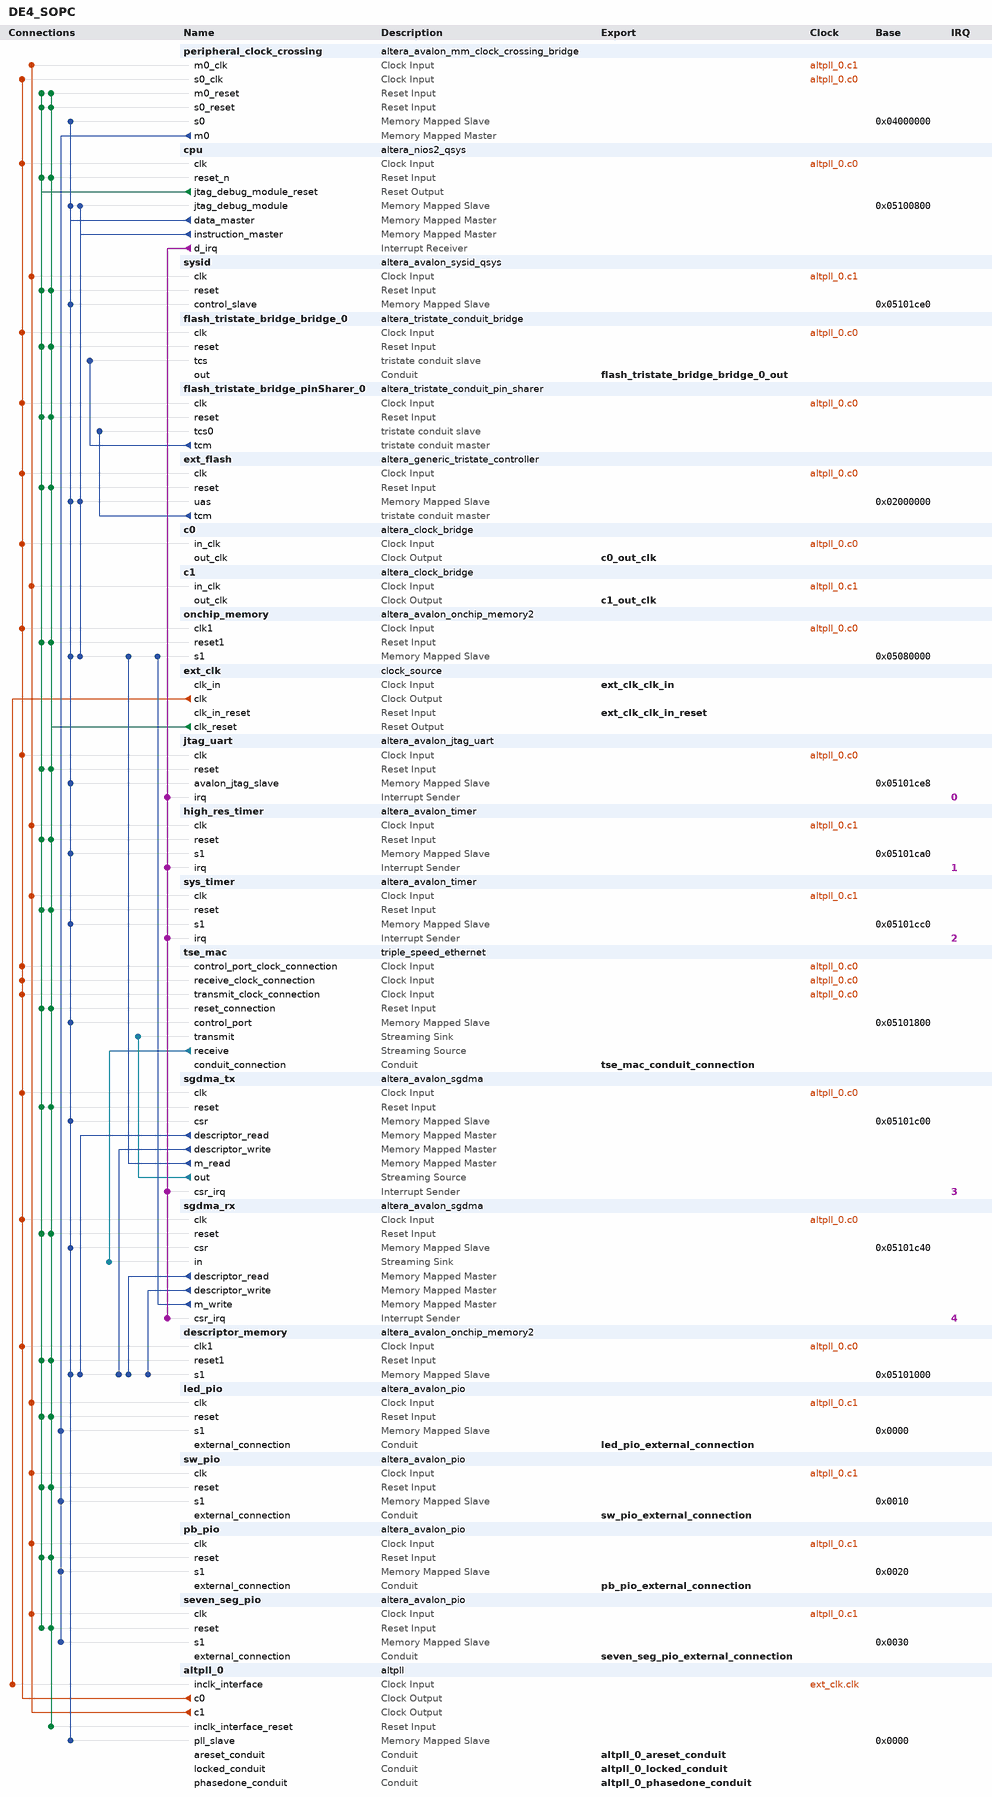
[diagram p0: system contents]
# Platform Designer (Qsys) system DE4_SOPC
# Parameters at their usual value, and those the tool derives, are not listed.
package require -exact qsys 11.1
create_system DE4_SOPC
set_project_property DEVICE_FAMILY STRATIXIV

add_instance peripheral_clock_crossing altera_avalon_mm_clock_crossing_bridge 11.1
set_instance_parameter_value peripheral_clock_crossing DATA_WIDTH 32
set_instance_parameter_value peripheral_clock_crossing ADDRESS_WIDTH 6
set_instance_parameter_value peripheral_clock_crossing MAX_BURST_SIZE 1
set_instance_parameter_value peripheral_clock_crossing COMMAND_FIFO_DEPTH 16
set_instance_parameter_value peripheral_clock_crossing RESPONSE_FIFO_DEPTH 64
set_instance_parameter_value peripheral_clock_crossing MASTER_SYNC_DEPTH 3
set_instance_parameter_value peripheral_clock_crossing SLAVE_SYNC_DEPTH 3

add_instance cpu altera_nios2_qsys 11.1
set_instance_parameter_value cpu manuallyAssignCpuID false
set_instance_parameter_value cpu resetSlave onchip_memory.s1
set_instance_parameter_value cpu exceptionSlave onchip_memory.s1
set_instance_parameter_value cpu breakSlave cpu.jtag_debug_module
set_instance_parameter_value cpu muldiv_multiplierType DSPBlock
set_instance_parameter_value cpu impl Fast
set_instance_parameter_value cpu icache_size 4096

add_instance sysid altera_avalon_sysid_qsys 11.1
set_instance_parameter_value sysid id 0

add_instance flash_tristate_bridge_bridge_0 altera_tristate_conduit_bridge 11.1

add_instance flash_tristate_bridge_pinSharer_0 altera_tristate_conduit_pin_sharer 11.1
set_instance_parameter_value flash_tristate_bridge_pinSharer_0 NUM_INTERFACES 1
set_instance_parameter_value flash_tristate_bridge_pinSharer_0 MODULE_ORIGIN_LIST ext_flash.tcm,ext_flash.tcm,ext_flash.tcm,ext_flash.tcm,ext_flash.tcm
set_instance_parameter_value flash_tristate_bridge_pinSharer_0 SHARED_SIGNAL_LIST flash_tristate_bridge_address,flash_tristate_bridge_readn,flash_tristate_bridge_writen,flash_tristate_bridge_data,select_n_to_the_ext_flash

add_instance ext_flash altera_generic_tristate_controller 11.1
set_instance_parameter_value ext_flash TCM_ADDRESS_W 25
set_instance_parameter_value ext_flash TCM_DATA_W 16
set_instance_parameter_value ext_flash TCM_BYTEENABLE_W 2
set_instance_parameter_value ext_flash TCM_READ_WAIT 100
set_instance_parameter_value ext_flash TCM_WRITE_WAIT 100
set_instance_parameter_value ext_flash TCM_SETUP_WAIT 25
set_instance_parameter_value ext_flash TCM_DATA_HOLD 20
set_instance_parameter_value ext_flash TCM_MAX_PENDING_READ_TRANSACTIONS 3
set_instance_parameter_value ext_flash TCM_TURNAROUND_TIME 2
set_instance_parameter_value ext_flash TCM_TIMING_UNITS 0
set_instance_parameter_value ext_flash TCM_READLATENCY 2
set_instance_parameter_value ext_flash TCM_SYMBOLS_PER_WORD 2
set_instance_parameter_value ext_flash USE_READ 1
set_instance_parameter_value ext_flash USE_BEGINTRANSFER 0
set_instance_parameter_value ext_flash USE_BYTEENABLE 0
set_instance_parameter_value ext_flash USE_OUTPUTENABLE 0
set_instance_parameter_value ext_flash ACTIVE_LOW_READ 1
set_instance_parameter_value ext_flash ACTIVE_LOW_BYTEENABLE 0
set_instance_parameter_value ext_flash ACTIVE_LOW_OUTPUTENABLE 0
set_instance_parameter_value ext_flash ACTIVE_LOW_BEGINTRANSFER 0
set_instance_parameter_value ext_flash CHIPSELECT_THROUGH_READLATENCY 0
set_instance_parameter_value ext_flash MODULE_ASSIGNMENT_KEYS embeddedsw.configuration.hwClassnameDriverSupportList,embeddedsw.configuration.hwClassnameDriverSupportDefault,embeddedsw.CMacro.SETUP_VALUE,embeddedsw.CMacro.WAIT_VALUE,embeddedsw.CMacro.HOLD_VALUE,embeddedsw.CMacro.TIMING_UNITS,embeddedsw.CMacro.SIZE,embeddedsw.memoryInfo.MEM_INIT_DATA_WIDTH,embeddedsw.memoryInfo.HAS_BYTE_LANE,embeddedsw.memoryInfo.IS_FLASH,embeddedsw.memoryInfo.GENERATE_DAT_SYM,embeddedsw.memoryInfo.GENERATE_FLASH,embeddedsw.memoryInfo.DAT_SYM_INSTALL_DIR,embeddedsw.memoryInfo.FLASH_INSTALL_DIR
set_instance_parameter_value ext_flash MODULE_ASSIGNMENT_VALUES {altera_avalon_lan91c111:altera_avalon_cfi_flash,altera_avalon_cfi_flash,25,100,20,"ns",33554432u,16,1,1,1,1,SIM_DIR,APP_DIR}
set_instance_parameter_value ext_flash INTERFACE_ASSIGNMENT_KEYS embeddedsw.configuration.isFlash,embeddedsw.configuration.isMemoryDevice,embeddedsw.configuration.isNonVolatileStorage
set_instance_parameter_value ext_flash INTERFACE_ASSIGNMENT_VALUES 1,1,1

add_instance c0 altera_clock_bridge 11.1
set_instance_parameter_value c0 DERIVED_CLOCK_RATE 50000000
set_instance_parameter_value c0 EXPLICIT_CLOCK_RATE 0

add_instance c1 altera_clock_bridge 11.1
set_instance_parameter_value c1 DERIVED_CLOCK_RATE 10000000
set_instance_parameter_value c1 EXPLICIT_CLOCK_RATE 0

add_instance onchip_memory altera_avalon_onchip_memory2 11.1
set_instance_parameter_value onchip_memory blockType M9K
set_instance_parameter_value onchip_memory dataWidth 32
set_instance_parameter_value onchip_memory dualPort false
set_instance_parameter_value onchip_memory initMemContent true
set_instance_parameter_value onchip_memory initializationFileName onchip_memory
set_instance_parameter_value onchip_memory memorySize 512000

add_instance ext_clk clock_source 11.1
set_instance_parameter_value ext_clk clockFrequency 50000000

add_instance jtag_uart altera_avalon_jtag_uart 11.1
set_instance_parameter_value jtag_uart simInteractiveOptions INTERACTIVE_ASCII_OUTPUT

add_instance high_res_timer altera_avalon_timer 11.1
set_instance_parameter_value high_res_timer period 1
set_instance_parameter_value high_res_timer periodUnits MSEC
set_instance_parameter_value high_res_timer timerPreset CUSTOM

add_instance sys_timer altera_avalon_timer 11.1
set_instance_parameter_value sys_timer period 10
set_instance_parameter_value sys_timer periodUnits MSEC
set_instance_parameter_value sys_timer timerPreset CUSTOM

add_instance tse_mac triple_speed_ethernet 11.1
set_instance_parameter_value tse_mac atlanticSinkClockRate 0
set_instance_parameter_value tse_mac atlanticSinkClockSource unassigned
set_instance_parameter_value tse_mac atlanticSourceClockRate 0
set_instance_parameter_value tse_mac atlanticSourceClockSource unassigned
set_instance_parameter_value tse_mac avalonSlaveClockRate 0
set_instance_parameter_value tse_mac avalonSlaveClockSource unassigned
set_instance_parameter_value tse_mac avalonStNeighbours {unassigned=unassigned}
set_instance_parameter_value tse_mac channel_count 1
set_instance_parameter_value tse_mac core_variation MAC_PCS
set_instance_parameter_value tse_mac core_version 2817
set_instance_parameter_value tse_mac crc32check16bit 0
set_instance_parameter_value tse_mac crc32dwidth 8
set_instance_parameter_value tse_mac crc32gendelay 6
set_instance_parameter_value tse_mac crc32s1l2_extern false
set_instance_parameter_value tse_mac cust_version 0
set_instance_parameter_value tse_mac dataBitsPerSymbol 8
set_instance_parameter_value tse_mac dev_version 2817
set_instance_parameter_value tse_mac eg_addr 11
set_instance_parameter_value tse_mac ena_hash true
set_instance_parameter_value tse_mac enable_alt_reconfig false
set_instance_parameter_value tse_mac enable_clk_sharing false
set_instance_parameter_value tse_mac enable_ena 32
set_instance_parameter_value tse_mac enable_fifoless false
set_instance_parameter_value tse_mac enable_gmii_loopback false
set_instance_parameter_value tse_mac enable_hd_logic true
set_instance_parameter_value tse_mac enable_mac_flow_ctrl true
set_instance_parameter_value tse_mac enable_mac_txaddr_set true
set_instance_parameter_value tse_mac enable_mac_vlan true
set_instance_parameter_value tse_mac enable_maclite false
set_instance_parameter_value tse_mac enable_magic_detect true
set_instance_parameter_value tse_mac enable_multi_channel false
set_instance_parameter_value tse_mac enable_pkt_class true
set_instance_parameter_value tse_mac enable_pma false
set_instance_parameter_value tse_mac enable_reg_sharing false
set_instance_parameter_value tse_mac enable_sgmii true
set_instance_parameter_value tse_mac enable_shift16 true
set_instance_parameter_value tse_mac enable_sup_addr true
set_instance_parameter_value tse_mac enable_use_internal_fifo true
set_instance_parameter_value tse_mac export_calblkclk false
set_instance_parameter_value tse_mac export_pwrdn false
set_instance_parameter_value tse_mac ext_stat_cnt_ena false
set_instance_parameter_value tse_mac gigeAdvanceMode true
set_instance_parameter_value tse_mac ifGMII MII_GMII
set_instance_parameter_value tse_mac ifPCSuseEmbeddedSerdes true
set_instance_parameter_value tse_mac ing_addr 11
set_instance_parameter_value tse_mac insert_ta true
set_instance_parameter_value tse_mac maclite_gige false
set_instance_parameter_value tse_mac max_channels 1
set_instance_parameter_value tse_mac mdio_clk_div 40
set_instance_parameter_value tse_mac phy_identifier 0
set_instance_parameter_value tse_mac ramType AUTO
set_instance_parameter_value tse_mac reset_level 1
set_instance_parameter_value tse_mac starting_channel_number 0
set_instance_parameter_value tse_mac stat_cnt_ena true
set_instance_parameter_value tse_mac timingAdapterName timingAdapter
set_instance_parameter_value tse_mac toolContext SOPC_BUILDER
set_instance_parameter_value tse_mac transceiver_type LVDS_IO
set_instance_parameter_value tse_mac uiHostClockFrequency 0
set_instance_parameter_value tse_mac uiMDIOFreq {0.0 MHz}
set_instance_parameter_value tse_mac useLvds true
set_instance_parameter_value tse_mac useMAC true
set_instance_parameter_value tse_mac useMDIO true
set_instance_parameter_value tse_mac usePCS true
set_instance_parameter_value tse_mac use_sync_reset true

add_instance sgdma_tx altera_avalon_sgdma 11.1
set_instance_parameter_value sgdma_tx enableBurstTransfers false
set_instance_parameter_value sgdma_tx enableUnalignedTransfers false
set_instance_parameter_value sgdma_tx readBlockDataWidth 32
set_instance_parameter_value sgdma_tx sinkErrorWidth 0
set_instance_parameter_value sgdma_tx sourceErrorWidth 1
set_instance_parameter_value sgdma_tx transferMode MEMORY_TO_STREAM
set_instance_parameter_value sgdma_tx writeBurstcountWidth 4

add_instance sgdma_rx altera_avalon_sgdma 11.1
set_instance_parameter_value sgdma_rx enableBurstTransfers false
set_instance_parameter_value sgdma_rx enableUnalignedTransfers false
set_instance_parameter_value sgdma_rx readBlockDataWidth 32
set_instance_parameter_value sgdma_rx sinkErrorWidth 6
set_instance_parameter_value sgdma_rx sourceErrorWidth 0
set_instance_parameter_value sgdma_rx transferMode STREAM_TO_MEMORY
set_instance_parameter_value sgdma_rx writeBurstcountWidth 4

add_instance descriptor_memory altera_avalon_onchip_memory2 11.1
set_instance_parameter_value descriptor_memory dataWidth 32
set_instance_parameter_value descriptor_memory dualPort false
set_instance_parameter_value descriptor_memory initMemContent true
set_instance_parameter_value descriptor_memory initializationFileName descriptor_memory
set_instance_parameter_value descriptor_memory memorySize 2048

add_instance led_pio altera_avalon_pio 11.1
set_instance_parameter_value led_pio direction Output
set_instance_parameter_value led_pio width 8

add_instance sw_pio altera_avalon_pio 11.1
set_instance_parameter_value sw_pio direction Input
set_instance_parameter_value sw_pio width 8

add_instance pb_pio altera_avalon_pio 11.1
set_instance_parameter_value pb_pio direction Input
set_instance_parameter_value pb_pio width 4

add_instance seven_seg_pio altera_avalon_pio 11.1
set_instance_parameter_value seven_seg_pio direction Output
set_instance_parameter_value seven_seg_pio width 16

add_instance altpll_0 altpll 11.1
set_instance_parameter_value altpll_0 WIDTH_CLOCK 10
set_instance_parameter_value altpll_0 INCLK0_INPUT_FREQUENCY 20000
set_instance_parameter_value altpll_0 CLK0_MULTIPLY_BY 1
set_instance_parameter_value altpll_0 CLK1_MULTIPLY_BY 1
set_instance_parameter_value altpll_0 CLK0_DIVIDE_BY 1
set_instance_parameter_value altpll_0 CLK1_DIVIDE_BY 5
set_instance_parameter_value altpll_0 CLK1_PHASE_SHIFT 0
set_instance_parameter_value altpll_0 CLK1_DUTY_CYCLE 50
set_instance_parameter_value altpll_0 PORT_clk1 PORT_USED
set_instance_parameter_value altpll_0 PORT_clk2 PORT_UNUSED
set_instance_parameter_value altpll_0 PORT_clk3 PORT_UNUSED
set_instance_parameter_value altpll_0 PORT_clk6 PORT_UNUSED
set_instance_parameter_value altpll_0 PORT_clk7 PORT_UNUSED
set_instance_parameter_value altpll_0 PORT_clk8 PORT_UNUSED
set_instance_parameter_value altpll_0 PORT_clk9 PORT_UNUSED
set_instance_parameter_value altpll_0 PORT_ARESET PORT_USED
set_instance_parameter_value altpll_0 PORT_LOCKED PORT_USED
set_instance_parameter_value altpll_0 PORT_FBOUT PORT_UNUSED
set_instance_parameter_value altpll_0 USING_FBMIMICBIDIR_PORT OFF

# connections
add_connection altpll_0.c0 c0.in_clk clock
add_connection altpll_0.c0 cpu.clk clock
add_connection altpll_0.c0 descriptor_memory.clk1 clock
add_connection altpll_0.c0 ext_flash.clk clock
add_connection altpll_0.c0 flash_tristate_bridge_bridge_0.clk clock
add_connection altpll_0.c0 flash_tristate_bridge_pinSharer_0.clk clock
add_connection altpll_0.c0 jtag_uart.clk clock
add_connection altpll_0.c0 onchip_memory.clk1 clock
add_connection altpll_0.c0 peripheral_clock_crossing.s0_clk clock
add_connection altpll_0.c0 sgdma_rx.clk clock
add_connection altpll_0.c0 sgdma_tx.clk clock
add_connection altpll_0.c0 tse_mac.control_port_clock_connection clock
add_connection altpll_0.c0 tse_mac.receive_clock_connection clock
add_connection altpll_0.c0 tse_mac.transmit_clock_connection clock
add_connection altpll_0.c1 c1.in_clk clock
add_connection altpll_0.c1 high_res_timer.clk clock
add_connection altpll_0.c1 led_pio.clk clock
add_connection altpll_0.c1 pb_pio.clk clock
add_connection altpll_0.c1 peripheral_clock_crossing.m0_clk clock
add_connection altpll_0.c1 seven_seg_pio.clk clock
add_connection altpll_0.c1 sw_pio.clk clock
add_connection altpll_0.c1 sys_timer.clk clock
add_connection altpll_0.c1 sysid.clk clock
add_connection ext_clk.clk altpll_0.inclk_interface clock
add_connection cpu.jtag_debug_module_reset cpu.reset_n reset
add_connection cpu.jtag_debug_module_reset descriptor_memory.reset1 reset
add_connection cpu.jtag_debug_module_reset ext_flash.reset reset
add_connection cpu.jtag_debug_module_reset flash_tristate_bridge_bridge_0.reset reset
add_connection cpu.jtag_debug_module_reset flash_tristate_bridge_pinSharer_0.reset reset
add_connection cpu.jtag_debug_module_reset high_res_timer.reset reset
add_connection cpu.jtag_debug_module_reset jtag_uart.reset reset
add_connection cpu.jtag_debug_module_reset led_pio.reset reset
add_connection cpu.jtag_debug_module_reset onchip_memory.reset1 reset
add_connection cpu.jtag_debug_module_reset pb_pio.reset reset
add_connection cpu.jtag_debug_module_reset peripheral_clock_crossing.m0_reset reset
add_connection cpu.jtag_debug_module_reset peripheral_clock_crossing.s0_reset reset
add_connection cpu.jtag_debug_module_reset seven_seg_pio.reset reset
add_connection cpu.jtag_debug_module_reset sgdma_rx.reset reset
add_connection cpu.jtag_debug_module_reset sgdma_tx.reset reset
add_connection cpu.jtag_debug_module_reset sw_pio.reset reset
add_connection cpu.jtag_debug_module_reset sys_timer.reset reset
add_connection cpu.jtag_debug_module_reset sysid.reset reset
add_connection cpu.jtag_debug_module_reset tse_mac.reset_connection reset
add_connection ext_clk.clk_reset altpll_0.inclk_interface_reset reset
add_connection ext_clk.clk_reset cpu.reset_n reset
add_connection ext_clk.clk_reset descriptor_memory.reset1 reset
add_connection ext_clk.clk_reset ext_flash.reset reset
add_connection ext_clk.clk_reset flash_tristate_bridge_bridge_0.reset reset
add_connection ext_clk.clk_reset flash_tristate_bridge_pinSharer_0.reset reset
add_connection ext_clk.clk_reset high_res_timer.reset reset
add_connection ext_clk.clk_reset jtag_uart.reset reset
add_connection ext_clk.clk_reset led_pio.reset reset
add_connection ext_clk.clk_reset onchip_memory.reset1 reset
add_connection ext_clk.clk_reset pb_pio.reset reset
add_connection ext_clk.clk_reset peripheral_clock_crossing.m0_reset reset
add_connection ext_clk.clk_reset peripheral_clock_crossing.s0_reset reset
add_connection ext_clk.clk_reset seven_seg_pio.reset reset
add_connection ext_clk.clk_reset sgdma_rx.reset reset
add_connection ext_clk.clk_reset sgdma_tx.reset reset
add_connection ext_clk.clk_reset sw_pio.reset reset
add_connection ext_clk.clk_reset sys_timer.reset reset
add_connection ext_clk.clk_reset sysid.reset reset
add_connection ext_clk.clk_reset tse_mac.reset_connection reset
add_connection cpu.data_master altpll_0.pll_slave avalon
set_connection_parameter_value cpu.data_master/altpll_0.pll_slave baseAddress 0x0000
add_connection cpu.data_master cpu.jtag_debug_module avalon
set_connection_parameter_value cpu.data_master/cpu.jtag_debug_module baseAddress 0x05100800
add_connection cpu.data_master descriptor_memory.s1 avalon
set_connection_parameter_value cpu.data_master/descriptor_memory.s1 baseAddress 0x05101000
add_connection cpu.data_master ext_flash.uas avalon
set_connection_parameter_value cpu.data_master/ext_flash.uas baseAddress 0x02000000
add_connection cpu.data_master high_res_timer.s1 avalon
set_connection_parameter_value cpu.data_master/high_res_timer.s1 baseAddress 0x05101ca0
add_connection cpu.data_master jtag_uart.avalon_jtag_slave avalon
set_connection_parameter_value cpu.data_master/jtag_uart.avalon_jtag_slave baseAddress 0x05101ce8
add_connection cpu.data_master onchip_memory.s1 avalon
set_connection_parameter_value cpu.data_master/onchip_memory.s1 baseAddress 0x05080000
add_connection cpu.data_master peripheral_clock_crossing.s0 avalon
set_connection_parameter_value cpu.data_master/peripheral_clock_crossing.s0 baseAddress 0x04000000
add_connection cpu.data_master sgdma_rx.csr avalon
set_connection_parameter_value cpu.data_master/sgdma_rx.csr baseAddress 0x05101c40
add_connection cpu.data_master sgdma_tx.csr avalon
set_connection_parameter_value cpu.data_master/sgdma_tx.csr baseAddress 0x05101c00
add_connection cpu.data_master sys_timer.s1 avalon
set_connection_parameter_value cpu.data_master/sys_timer.s1 baseAddress 0x05101cc0
add_connection cpu.data_master sysid.control_slave avalon
set_connection_parameter_value cpu.data_master/sysid.control_slave baseAddress 0x05101ce0
add_connection cpu.data_master tse_mac.control_port avalon
set_connection_parameter_value cpu.data_master/tse_mac.control_port baseAddress 0x05101800
add_connection cpu.instruction_master cpu.jtag_debug_module avalon
set_connection_parameter_value cpu.instruction_master/cpu.jtag_debug_module baseAddress 0x05100800
add_connection cpu.instruction_master ext_flash.uas avalon
set_connection_parameter_value cpu.instruction_master/ext_flash.uas baseAddress 0x02000000
add_connection cpu.instruction_master onchip_memory.s1 avalon
set_connection_parameter_value cpu.instruction_master/onchip_memory.s1 baseAddress 0x05080000
add_connection peripheral_clock_crossing.m0 led_pio.s1 avalon
set_connection_parameter_value peripheral_clock_crossing.m0/led_pio.s1 baseAddress 0x0000
add_connection peripheral_clock_crossing.m0 pb_pio.s1 avalon
set_connection_parameter_value peripheral_clock_crossing.m0/pb_pio.s1 baseAddress 0x0020
add_connection peripheral_clock_crossing.m0 seven_seg_pio.s1 avalon
set_connection_parameter_value peripheral_clock_crossing.m0/seven_seg_pio.s1 baseAddress 0x0030
add_connection peripheral_clock_crossing.m0 sw_pio.s1 avalon
set_connection_parameter_value peripheral_clock_crossing.m0/sw_pio.s1 baseAddress 0x0010
add_connection sgdma_rx.descriptor_read descriptor_memory.s1 avalon
set_connection_parameter_value sgdma_rx.descriptor_read/descriptor_memory.s1 baseAddress 0x05101000
add_connection sgdma_rx.descriptor_write descriptor_memory.s1 avalon
set_connection_parameter_value sgdma_rx.descriptor_write/descriptor_memory.s1 baseAddress 0x05101000
add_connection sgdma_rx.m_write onchip_memory.s1 avalon
set_connection_parameter_value sgdma_rx.m_write/onchip_memory.s1 baseAddress 0x05080000
add_connection sgdma_tx.descriptor_read descriptor_memory.s1 avalon
set_connection_parameter_value sgdma_tx.descriptor_read/descriptor_memory.s1 baseAddress 0x05101000
add_connection sgdma_tx.descriptor_write descriptor_memory.s1 avalon
set_connection_parameter_value sgdma_tx.descriptor_write/descriptor_memory.s1 baseAddress 0x05101000
add_connection sgdma_tx.m_read onchip_memory.s1 avalon
set_connection_parameter_value sgdma_tx.m_read/onchip_memory.s1 baseAddress 0x05080000
add_connection sgdma_tx.out tse_mac.transmit avalon_streaming
add_connection tse_mac.receive sgdma_rx.in avalon_streaming
add_connection cpu.d_irq high_res_timer.irq interrupt
set_connection_parameter_value cpu.d_irq/high_res_timer.irq irqNumber 1
add_connection cpu.d_irq jtag_uart.irq interrupt
set_connection_parameter_value cpu.d_irq/jtag_uart.irq irqNumber 0
add_connection cpu.d_irq sgdma_rx.csr_irq interrupt
set_connection_parameter_value cpu.d_irq/sgdma_rx.csr_irq irqNumber 4
add_connection cpu.d_irq sgdma_tx.csr_irq interrupt
set_connection_parameter_value cpu.d_irq/sgdma_tx.csr_irq irqNumber 3
add_connection cpu.d_irq sys_timer.irq interrupt
set_connection_parameter_value cpu.d_irq/sys_timer.irq irqNumber 2
add_connection ext_flash.tcm flash_tristate_bridge_pinSharer_0.tcs0 tristate_conduit
add_connection flash_tristate_bridge_pinSharer_0.tcm flash_tristate_bridge_bridge_0.tcs tristate_conduit

# exported interfaces
add_interface c1_out_clk clock source
set_interface_property c1_out_clk EXPORT_OF c1.out_clk
add_interface ext_clk_clk_in_reset reset sink
set_interface_property ext_clk_clk_in_reset EXPORT_OF ext_clk.clk_in_reset
add_interface sw_pio_external_connection conduit end
set_interface_property sw_pio_external_connection EXPORT_OF sw_pio.external_connection
add_interface flash_tristate_bridge_bridge_0_out conduit end
set_interface_property flash_tristate_bridge_bridge_0_out EXPORT_OF flash_tristate_bridge_bridge_0.out
add_interface seven_seg_pio_external_connection conduit end
set_interface_property seven_seg_pio_external_connection EXPORT_OF seven_seg_pio.external_connection
add_interface c0_out_clk clock source
set_interface_property c0_out_clk EXPORT_OF c0.out_clk
add_interface led_pio_external_connection conduit end
set_interface_property led_pio_external_connection EXPORT_OF led_pio.external_connection
add_interface ext_clk_clk_in clock sink
set_interface_property ext_clk_clk_in EXPORT_OF ext_clk.clk_in
add_interface tse_mac_conduit_connection conduit end
set_interface_property tse_mac_conduit_connection EXPORT_OF tse_mac.conduit_connection
add_interface pb_pio_external_connection conduit end
set_interface_property pb_pio_external_connection EXPORT_OF pb_pio.external_connection
add_interface altpll_0_areset_conduit conduit end
set_interface_property altpll_0_areset_conduit EXPORT_OF altpll_0.areset_conduit
add_interface altpll_0_locked_conduit conduit end
set_interface_property altpll_0_locked_conduit EXPORT_OF altpll_0.locked_conduit
add_interface altpll_0_phasedone_conduit conduit end
set_interface_property altpll_0_phasedone_conduit EXPORT_OF altpll_0.phasedone_conduit

save_system DE4_SOPC.qsys
